# Altium project Input_Accessory.PrjPcb
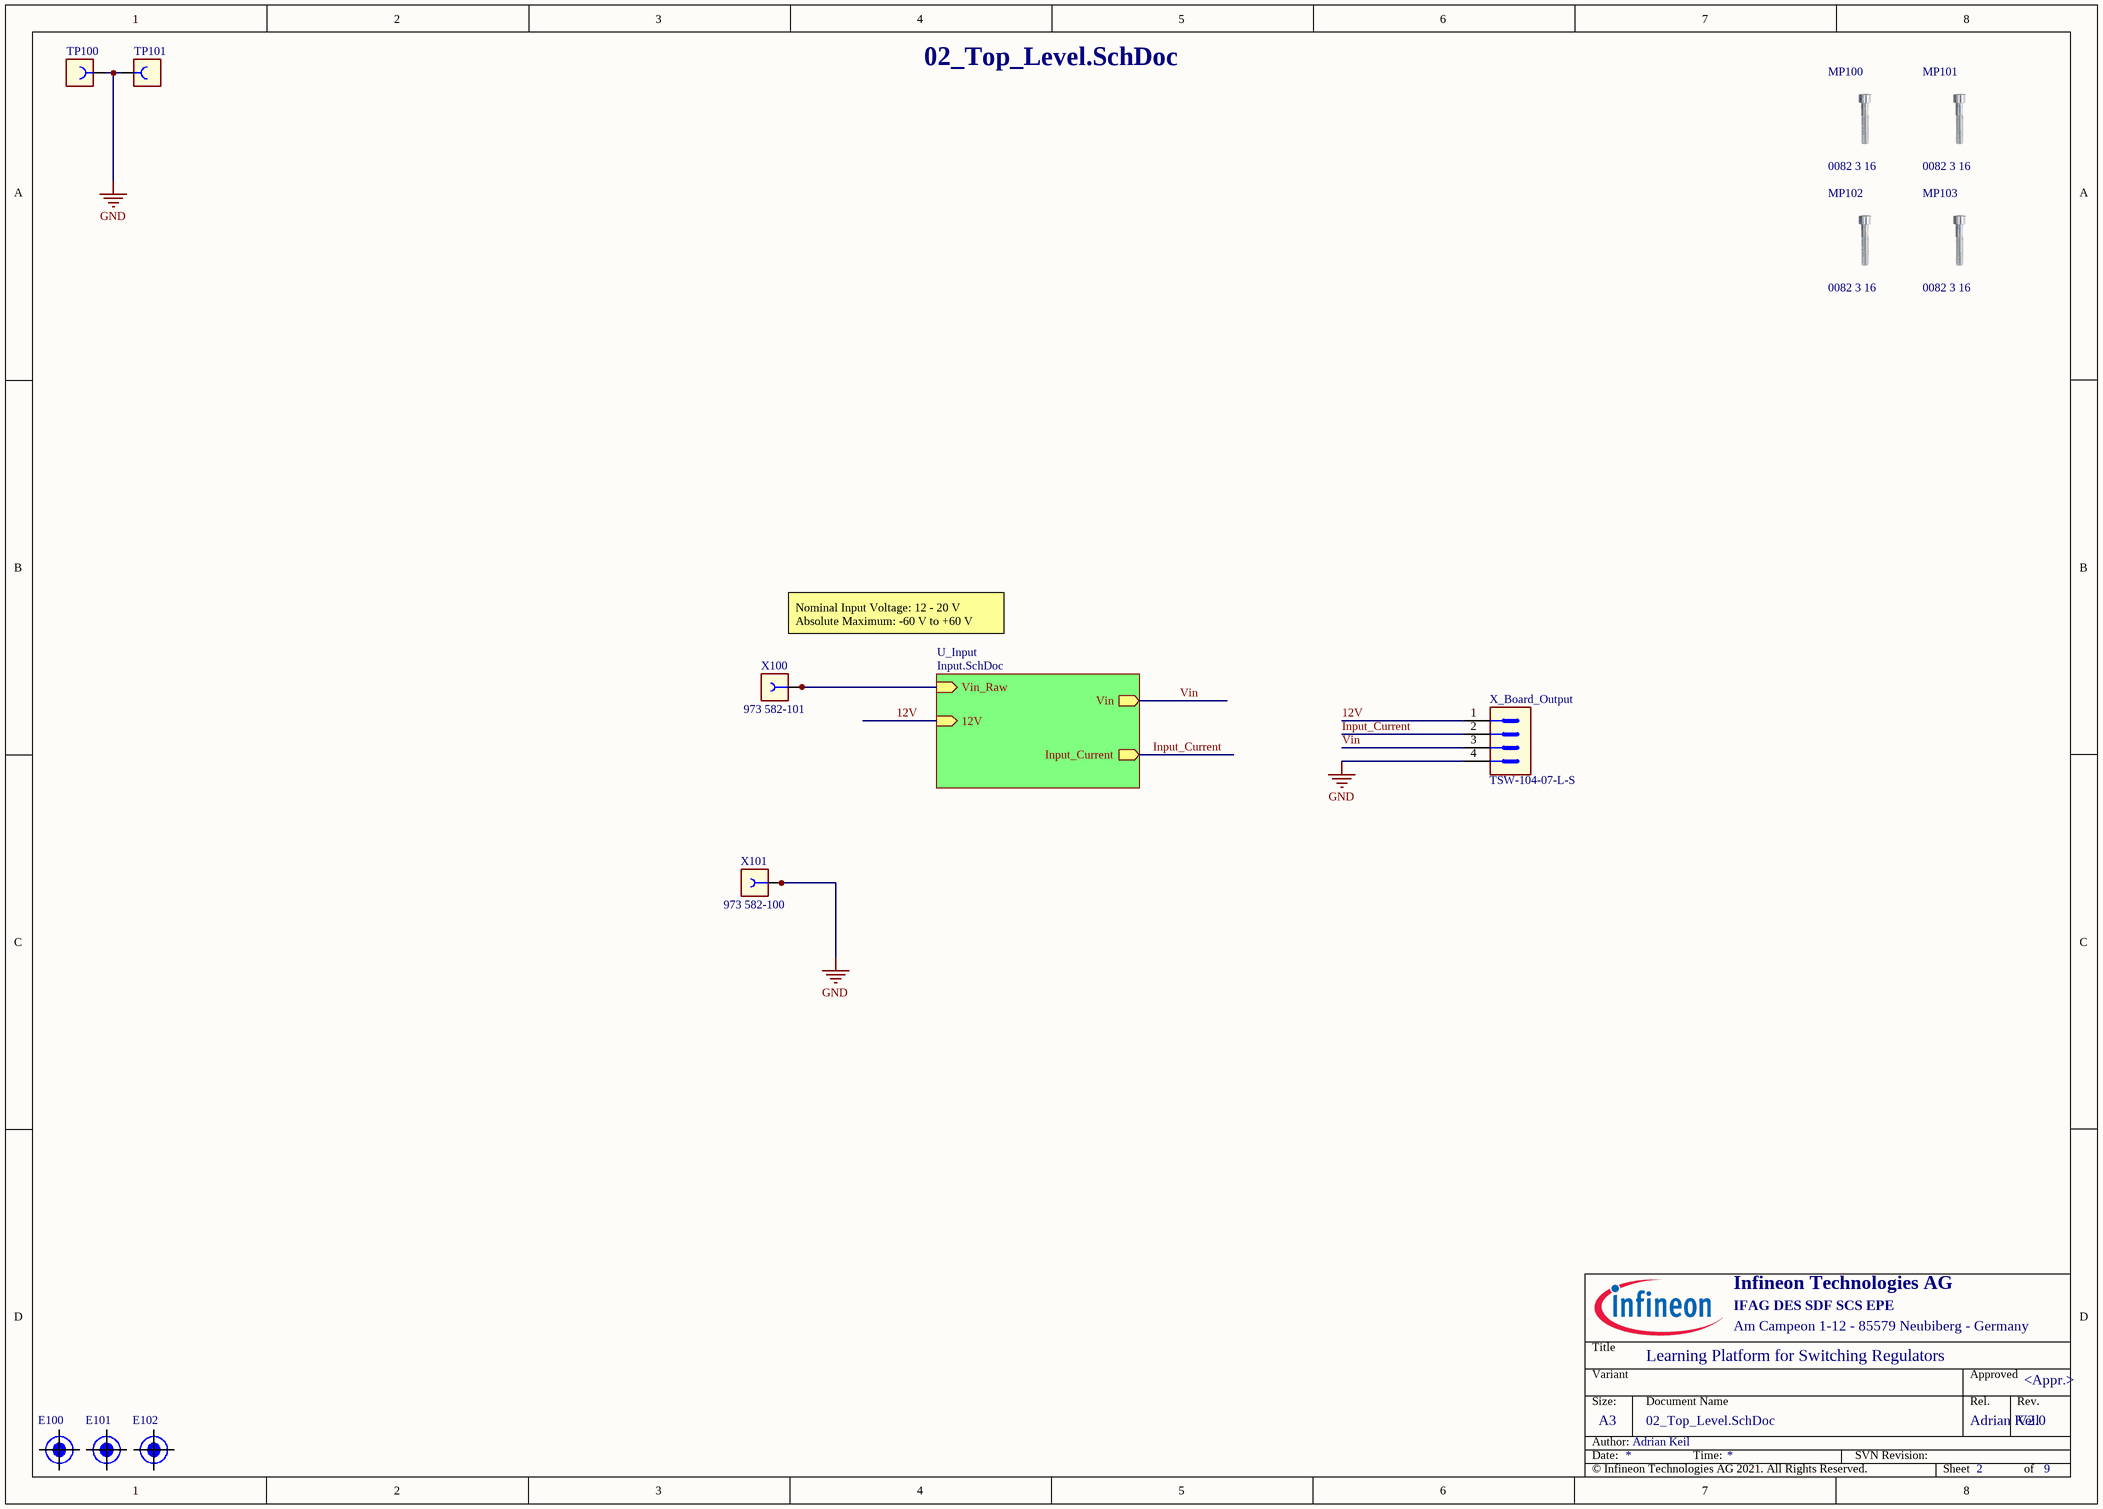
[diagram p0: 02_Top_Level.SchDoc]
PRJ_Address1: IFAG DES SDF SCS EPE; PRJ_Address2: Am Campeon 1-12 - 85579 Neubiberg - Germany; PRJ_Copyright: © Infineon Technologies AG 2021. All Rights Reserved.; PRJ_Engineer: Adrian Keil; PRJ_Organization: Infineon Technologies AG; PRJ_PCB_Release: RC01; PRJ_PCB_Revision: V1.2; PRJ_PCBDesigner: Adrian Keil; PRJ_Responsible: Adrian Keil; PRJ_Revision: V2.0; PRJ_SCH_Author: Adrian Keil; PRJ_SCH_Revision: V2.0; PRJ_Title: Learning Platform for Switching Regulators; PRJ_Year: 12/2021
2 sheets, 45 parts. Net scope: hierarchical (ports join the sheet entries above them; power ports are global).
Board file: Input_Accessory.PcbDoc
Sheets:
  02_Top_Level.SchDoc
    U_Input = Input.SchDoc

## Sheet 02_Top_Level.SchDoc: <Project Name>
size A3; ApprovedBy: <Appr.>; Author: <Author>; CompanyName: Infineon Technologies AG; Engineer: <Rel.>; Organization: Infineon Technologies AG; Address1: COM AC SDC SD3; Address2: Am Campeon 1-12  -  85579 Neubiberg  -  Germany; Address3: 85579 Neubiberg; Address4: Germany; DocumentNumber: 2; Revision: <Rev.>; SheetNumber: 2; SheetTotal: 9; Release: RC00; PageSetup: Record=PageOptions|CenterHorizontal=True|CenterVertical=True|PrintScale=1.01|XCorrection=1.00|YCorrection=1.00|PrintKind=0|BorderSize=5000000|LeftOffset=0|BottomOffset=0|Orientation=2|PaperLength=1000|PaperWidth=1000|Scale=100|PaperSource=7|PrintQuality=-4|MediaType=1|DitherType=10|PaperKind=A3|PrintScaleMode=1; Doc_ConfidentialStatus: <Doc_ConfidentialStatus>; Doc_Preliminary: <Doc_Preliminary>

### Parts
E100  (no value)  [fiducial]  (no BOM)
E101  (no value)  [fiducial]  (no BOM)
E102  (no value)  [fiducial]  (no BOM)
MP100  0082 3 16  [SCREW_0082 3 16_NPTH]
MP101  0082 3 16  [SCREW_0082 3 16_NPTH]
MP102  0082 3 16  [SCREW_0082 3 16_NPTH]
MP103  0082 3 16  [SCREW_0082 3 16_NPTH]
TP100  5011  [CON-THT-TP-5011]  (value not drawn)
TP101  5011  [CON-THT-TP-5011]  (value not drawn)
X100  973 582-101  [CON-THT-973 582- 101]
X101  973 582-100  [CON-THT-973 582- 100]
X_Board_Output  TSW-104-07-L-S  [HDRV4W64P254_1X4_1022X254X838B]

### Sub-sheets
U_Input = Input.SchDoc: Vin_Raw (in), Vin (out), Input_Current (out), 12V (in)

### Nets
GND: TP100.1 TP101.1 X101.1 X101.2 X_Board_Output.4
12V: X_Board_Output.1 ; sheet U_Input/12V
Input_Current: X_Board_Output.2 ; sheet U_Input/Input_Current
Vin: X_Board_Output.3 ; sheet U_Input/Vin
NetQ200_2: X100.1 X100.2 ; sheet U_Input/Vin_Raw

Not connected (* = marked no-connect by the designer): E100 1; E101 1; E102 1

### Notes on the sheet
- Nominal Input Voltage: 12 - 20 V
  Absolute Maximum: -60 V to +60 V
- Title
- Variant
- Approved
- Date:
- Author:
- Size:
- A3
- Document Name
- Time:
- SVN Revision:
- Rel.
- Rev.
- Sheet
- of

### Library data of the parts
E100-E102 = 416637: Fiducial Mark; Legacy PartNumber: MEC10000008; Manufacturer: Infineon Technologies; Alternate View: No; Symbol Type: Fiducial Marker For PCB; Article Number: 416637; Version Number: V01; Legacy DeviceID: MEC_Fiducial_Mark; Combined Parameters: - - -x- -; ComponentStatus: Released; PLMStatus: Active; Second Source allowed: Yes; Voltage DC (max): na; Multible Parts: No; Part Type: Mechanical; Temperature min: 0; Temperature max: 0; Temperature Range: Military; ComponentLink1Description: Vendor WebSite; ComponentLink1URL: https://www.infineon.com/; ComponentLink2Description: Datasheet; ComponentLink2URL: http://webnetprod.muc.infineon.com/PCBPortal_Prod/WorkFlows/AltiumComponent/StandardDocumentation?Versionid=416638; Supplier 1: Farnell; Supplier 2: DigiKey; Supplier 3: Mouser
MP100-MP103 = 455343: Cheese Head Screw With Hexagon Socket, DIN 912 (ISO 4762), M3, 16mm length; Legacy PartNumber: MEC10000167; Manufacturer: Wurth Elektronik; Alternate View: No; Symbol Type: Cheese-Head Screw, M2.5X5-DIN 912; Article Number: 455343; Version Number: V01; Legacy DeviceID: MEC_0082 3 16; Combined Parameters: Steel Hexagonal 19x5.68 Screw; Style: Hexagonal; ComponentStatus: Released; PLMStatus: Active; Second Source allowed: Yes; Voltage DC (max): na; Multiple Parts: No; Part Type: Mechanical; Manufacturer Order Number: 0082 3 16; Value: 0082 3 16; QuickPick: Screw; Type: Screw; Temperature min: 0; Temperature max: 0; Temperature Range: Military; ROHS Compliant: N; Automotive Qualified: No; PackageReference: THT; ComponentLink1Description: Vendor WebSite; ComponentLink1URL: http://www.we-online.com; ComponentLink2Description: Datasheet; ComponentLink2URL: http://webnetprod.muc.infineon.com/PCBPortal_Prod/WorkFlows/AltiumComponent/StandardDocumentation?Versionid=455344; Supplier 1: Farnell; Supplier 2: DigiKey; Supplier 3: Mouser; Package Description: M3 Cheese Head Screw X 5.68mm Head
TP100 TP101 = 382410: PC Test Point-Multipurpose THT, Black; Multiple Parts: No; Legacy PartNumber: CON01500530; Manufacturer: Keystone Electronics Corp.; Symbol Type: Connector, 1 Lead, Female; Alternate View: Yes; Article Number: 382410; Version Number: V01; Legacy DeviceID: KEY_5011; Combined Parameters: Board-to-Cable None (onboard);1x1;Mounting:THT;Orient:0° (vertical);Shielded:No; QuickPick: 0° (vertical) / Board-to-Cable; Style: Not Applicable; ComponentStatus: Released; PLMStatus: Active; Voltage DC (max): na; Part Type: Connector; Manufacturer Order Number: 5011; Value: 5011; Type: Board-to-Cable; Application: Test; Temperature min: 0; Temperature max: 0; Temperature Range: Military; ROHS Compliant: Y; Automotive Qualified: No; ComponentLink1Description: Vendor WebSite; ComponentLink1URL: http://www.keyelco.com/; ComponentLink2Description: Datasheet; ComponentLink2URL: http://webnetprod.muc.infineon.com/PCBPortal_Prod/WorkFlows/AltiumComponent/StandardDocumentation?Versionid=382411; Supplier 1: Farnell; Supplier Part Number 1: 2431148; Supplier 2: DigiKey; Supplier Part Number 2: 36-5011-ND; Supplier 3: Mouser; Supplier Part Number 3: 534-5011; Second Source allowed: Yes; Package Description: Test Point, 1.78 mm Lead Width, Round, 3.17 mm Dia X 8.28 mm H body
X100 = 377341: Banana Socket, Red, 17.5mm Pitch; Legacy PartNumber: CON01500041; Manufacturer: Hirschmann Test & Measurement; Manufacturer Component Status: Active; Symbol Type: Banana Socket 2 Pins; Article Number: 377341; Version Number: V01; Legacy DeviceID: HTM_973 582- 101; Combined Parameters: Board-to-Cable Socket (female);2x1;Mounting:THT;Orient:90° (right angle);Shielded:No; QuickPick: 90° (right angle) / Board-to-Cable; ComponentStatus: Released; Second Source allowed: Yes; Voltage DC (max): na; Part Type: Connector; Manufacturer Order Number: 973 582-101; Value: 973 582-101; Type: Board-to-Cable; Style: Banana; Temperature min: -25; Temperature max: 85; Temperature Range: Military; ROHS Compliant: N; ComponentLink1Description: Vendor WebSite; ComponentLink1URL: http://www.sks-kontakt.de/; ComponentLink2Description: Datasheet; ComponentLink2URL: http://webnetprod.muc.infineon.com/PCBPortal_Prod/WorkFlows/AltiumComponent/StandardDocumentation?Versionid=377342; Supplier 1: Farnell; Supplier Part Number 1: 497332; Supplier 2: DigiKey; Supplier 3: Mouser; Supplier Part Number 3: 845-973582101; PLMStatus: Active; Package Description: Banana Jack, 2 pins, 17.5mm Pitch, 21mm L X 7.5mm W X 10.5mm H body
X101 = 377401: Banana Socket, black, 17.5mm Pitch; Legacy PartNumber: CON01500045; Manufacturer: Hirschmann Test & Measurement; Manufacturer Component Status: Active; Symbol Type: Banana Socket 2 Pins; Article Number: 377401; Version Number: V01; Legacy DeviceID: HTM_973 582- 100; Combined Parameters: Board-to-Cable Socket (female);-x-;Mounting:THT;Orient:90° (right angle);Shielded:No; QuickPick: 90° (right angle) / Board-to-Cable; Automotive Qualified: No; ComponentStatus: Released; Second Source allowed: Yes; Voltage DC (max): na; Part Type: Connector; Manufacturer Order Number: 973 582-100; Value: 973 582-100; Type: Board-to-Cable; Style: Banana; Temperature min: -25; Temperature max: 85; Temperature Range: Military; ROHS Compliant: N; ComponentLink1Description: Vendor WebSite; ComponentLink1URL: http://www.sks-kontakt.de/; ComponentLink2Description: Datasheet; ComponentLink2URL: http://webnetprod.muc.infineon.com/PCBPortal_Prod/WorkFlows/AltiumComponent/StandardDocumentation?Versionid=377402; Supplier 1: Farnell; Supplier Part Number 1: 497344; Supplier 2: DigiKey; Supplier 3: Mouser; Supplier Part Number 3: 845-973582100; PLMStatus: Active; Package Description: Banana Jack, 2 pins, 17.5mm Pitch, 21mm L X 7.5mm W X 10.5mm H body
X_Board_Output = 378073: Through hole .025 SQ Post Header, 2.54mm pitch, 4 pin, vertical, single row; Legacy PartNumber: CON01500102; Manufacturer: Samtec; Article Number: 378073; Version Number: V01; Legacy DeviceID: SAM_TSW-104-07-L-S; Combined Parameters: Board-to-Board Header (male);4x1;Mounting:THT;Orient:0° (vertical);Shielded:No; QuickPick: 0° (vertical) / Board-to-Board; Style: Strip; Automotive Qualified: No; ComponentStatus: Released; PLMStatus: Active; Second Source allowed: Yes; Voltage DC (max): na; Part Type: Connector; Manufacturer Order Number: TSW-104-07-L-S; Value: TSW-104-07-L-S; Type: Board-to-Board; Temperature min: -55; Temperature max: 125; Temperature Range: Military; ROHS Compliant: Y; ComponentLink1Description: Vendor WebSite; ComponentLink1URL: http://www.samtec.com/; ComponentLink2Description: Datasheet; ComponentLink2URL: http://webnetprod.muc.infineon.com/PCBPortal_Prod/WorkFlows/AltiumComponent/StandardDocumentation?Versionid=378074; Supplier 1: Farnell; Supplier Part Number 1: 2035607; Supplier 2: DigiKey; Supplier Part Number 2: SAM1031-04-ND; Supplier 3: Mouser; Package Description: Header,vertical,2.54mm pitch;0.64mm lead width,4 pins,1 row,4 pins per row,10.225mm L X 2.54mm W X 8.38mm H body

## Sheet Input.SchDoc: <Project Name>
size A3; ApprovedBy: <Appr.>; Author: <Author>; CompanyName: Infineon Technologies AG; Engineer: <Rel.>; Organization: Infineon Technologies AG; Address1: IFAG DES S PS; Address2: Am Campeon 1-12  -  85579 Neubiberg  -  Germany; Address3: 85579 Neubiberg; Address4: Germany; DocumentNumber: 3; Revision: <Rev.>; SheetNumber: 3; SheetTotal: 9; Release: RC00; PageSetup: Record=PageOptions|CenterHorizontal=True|CenterVertical=True|PrintScale=1.01|XCorrection=1.00|YCorrection=1.00|PrintKind=0|BorderSize=5000000|LeftOffset=0|BottomOffset=0|Orientation=2|PaperLength=1000|PaperWidth=1000|Scale=100|PaperSource=7|PrintQuality=-4|MediaType=1|DitherType=10|PaperKind=A3|PrintScaleMode=1; Doc_ConfidentialStatus: <Doc_ConfidentialStatus>; Doc_Preliminary: <Doc_Preliminary>
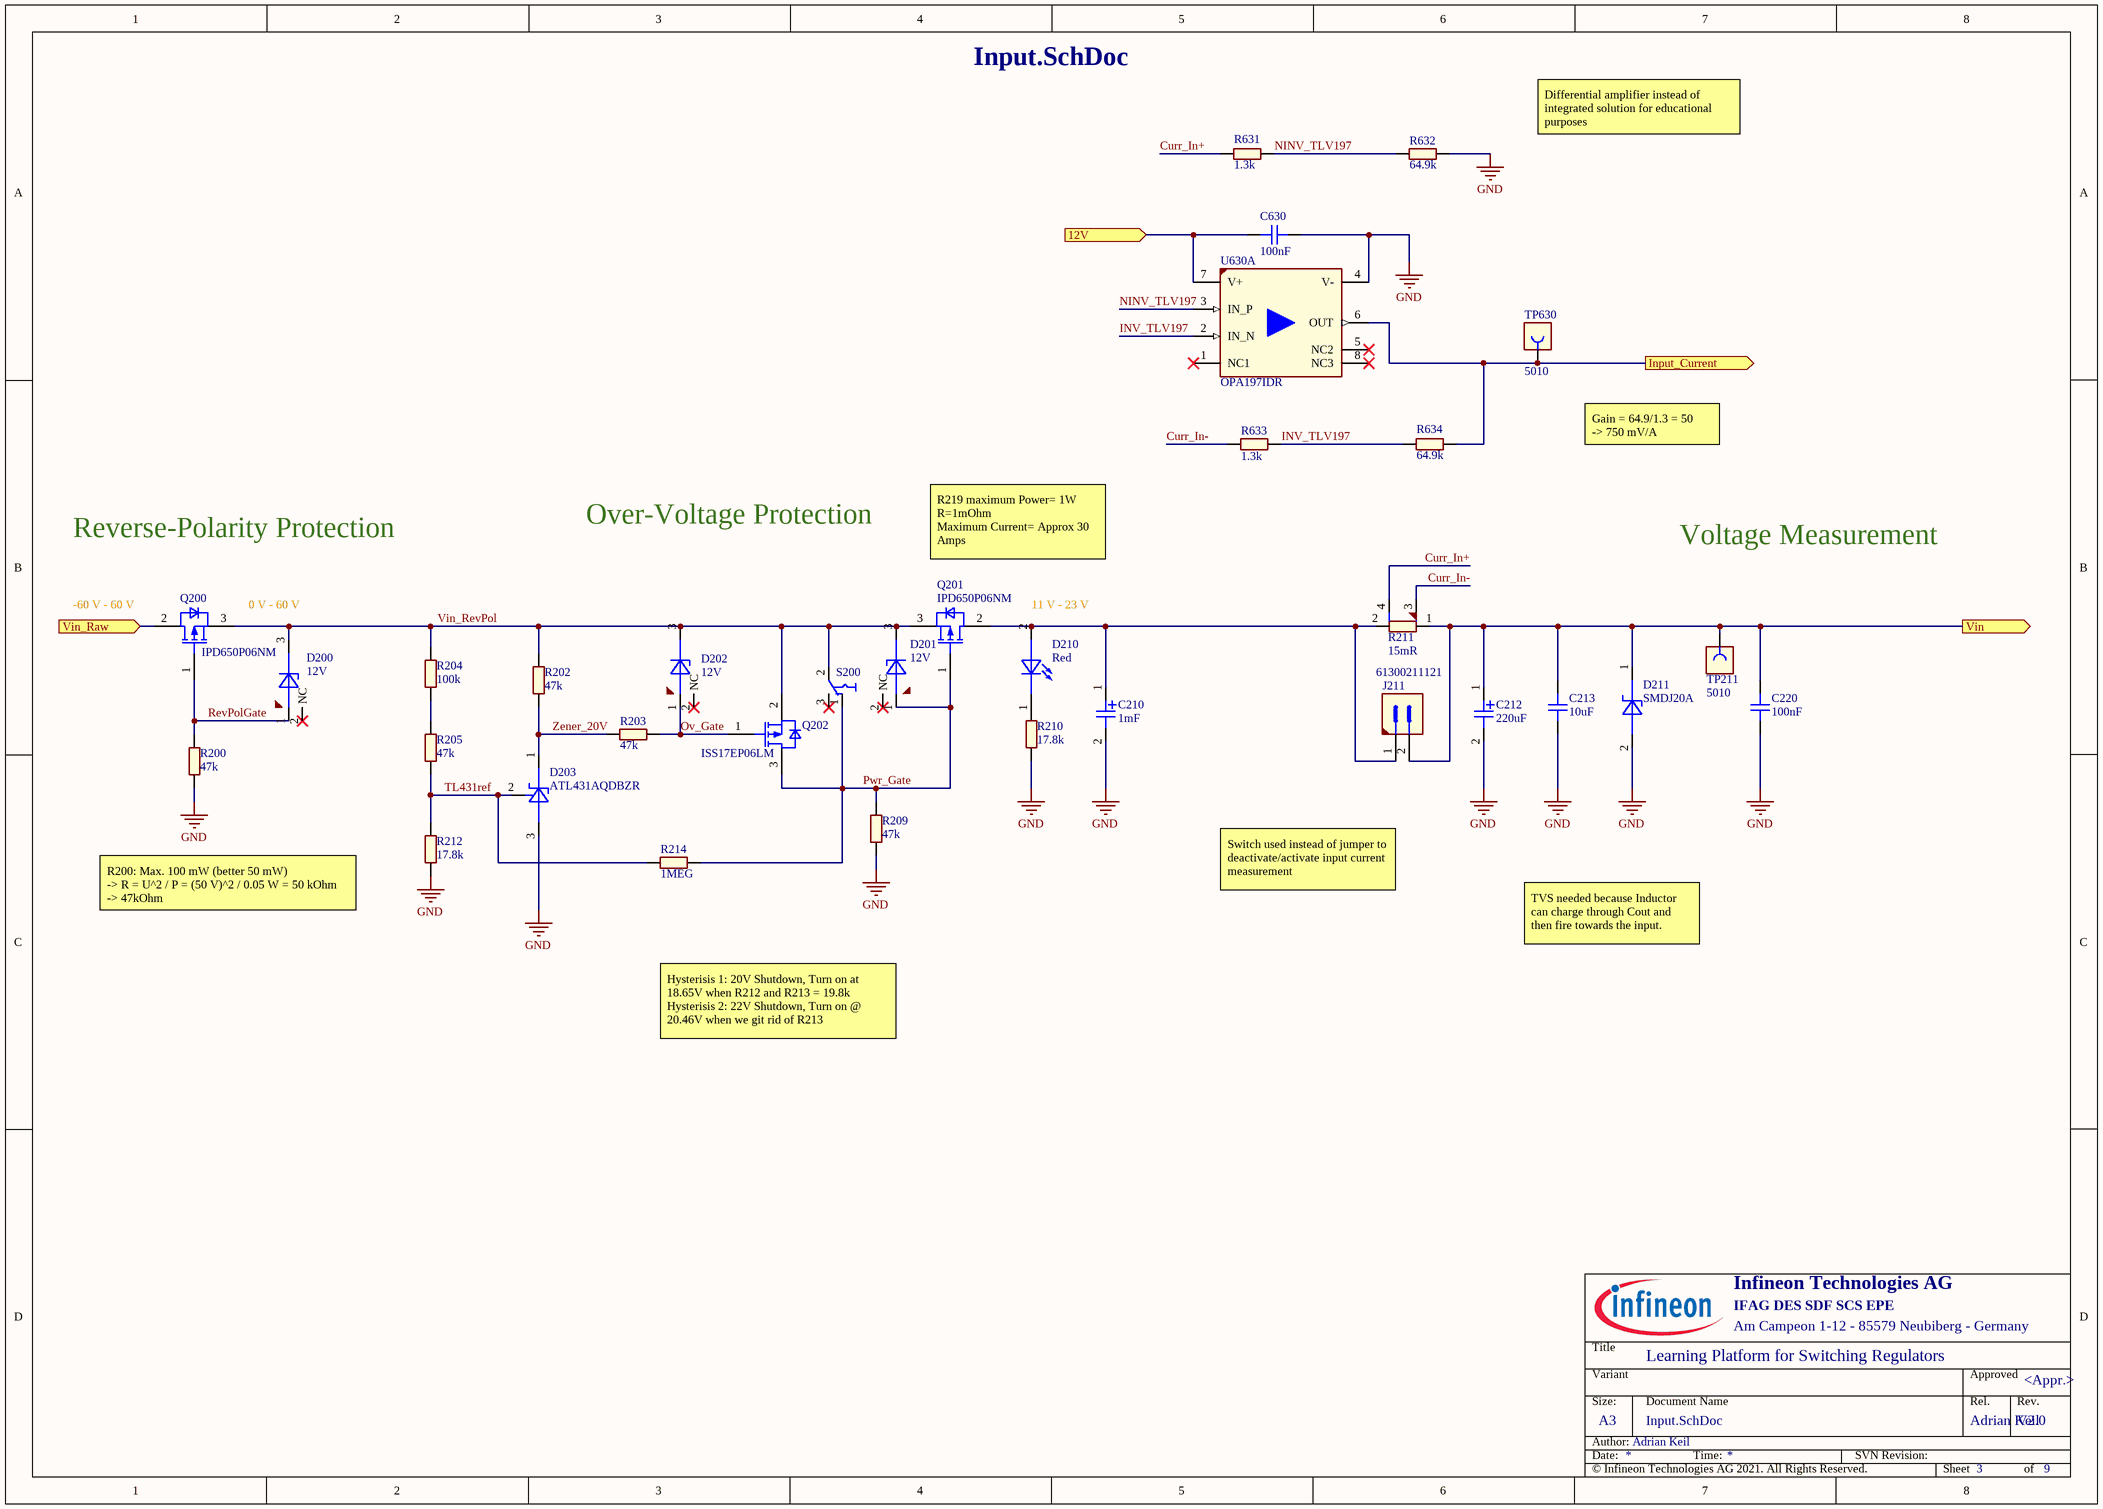
[diagram p1: Input.SchDoc]

### Parts
C210  1mF  [CAPPRD500W60D1300H2700B]
C212  220uF  [CAPAE1030X1050N-3]
C213  10uF  [CAPC3216X190N-1]
C220  100nF  [CAPC3216X125N-0]
C630  100nF  [CAPC3216X125N-0]
D200  12V  [SOT95P230X110-3N]
D201  12V  [SOT95P230X110-3N]
D202  12V  [SOT95P230X110-3N]
D203  ATL431AQDBZR  [SOT95P237X112-3N-1]
D210  Red  [LEDSC160X80X80-2N-1]
D211  SMDJ20A  [DIOM7959X262N]
J211  61300211121  [CON-M-THT-61300211121]
Q200  IPD650P06NM  [TO228P998X250-3N-V2]
Q201  IPD650P06NM  [TO228P998X250-3N-V2]
Q202  ISS17EP06LM  [SOT95P240X110-3N-1-V]
R200  47k  [RESC3216X60N]
R202  47k  [RESC3216X60N]
R203  47k  [RESC3216X60N]
R204  100k  [RESC3216X60N]
R205  47k  [RESC3216X60N]
R209  47k  [RESC3216X60N]
R210  17.8k  [RESC3216X60N]
R211  15mR  [RES-SMD-L4T12]
R212  17.8k  [RESC3216X60N]
R214  1MEG  [RESC3216X60N]
R631  1.3k  [RESC3216X60N]
R632  64.9k  [RESC3216X60N]
R633  1.3k  [RESC3216X60N]
R634  64.9k  [RESC3216X60N]
S200  CL-SB-12A-01T  [SW-SMD-CL-SB-12A-01T]  (value not drawn)
TP211  5010  [CON-THT-TP-5010]
TP630  5010  [CON-THT-TP-5010]
U630  OPA197IDR  [SOIC127P600X175-8N-23]  (part A of 2)

### Ports
12V (in), Input_Current (out), Vin (out), Vin_Raw (in)

### Nets
GND: C210.2 C212.2 C213.1 C220.2 C630.1 D203.3(ANODE) D211.2(ANODE) R200.1 R209.1 R210.2 R212.2 R632.2 U630.4(V-)
12V: C630.2 U630.7(V+) ; port 12V
Curr_In+: R211.4(I2) R631.1
Curr_In-: R211.3(I1) R633.1
Input_Current: R634.2 TP630.1 U630.6(OUT) ; port Input_Current
INV_TLV197: R633.2 R634.1 U630.2(IN_N)
NINV_TLV197: R631.2 R632.1 U630.3(IN_P)
Ov_Gate: D202.1(ANODE) Q202.1(GATE) R203.1
Pwr_Gate: D201.1(ANODE) Q201.1(GATE) Q202.3(DRAIN) R209.2 R214.2 S200.1
RevPolGate: D200.1(ANODE) Q200.1(GATE) R200.2
TL431ref: D203.2(REF) R205.1 R212.1 R214.1
Vin: C212.1 C213.2 C220.1 D211.1(CATHODE) J211.2 R211.1(V1) TP211.1 ; port Vin
Vin_RevPol: D200.3(CATHODE) D201.3(CATHODE) D202.3(CATHODE) Q200.3(SOURCE) Q201.3(SOURCE) Q202.2(SOURCE) R202.2 R204.1 S200.2
Zener_20V: D203.1(CATHODE) R202.1 R203.2
NetC210_1: C210.1 D210.2(Anode) J211.1 Q201.2(DRAIN) R211.2(V2)
NetD210_1: D210.1(Cathode) R210.1
NetQ200_2: Q200.2(DRAIN) ; port Vin_Raw
NetR204_2: R204.2 R205.2

Not connected (* = marked no-connect by the designer): D200 2(NC)*; D201 2(NC)*; D202 2(NC)*; S200 3*; U630 1(NC1)* 5(NC2)* 8(NC3)*

### Notes on the sheet
- Differential amplifier instead of integrated solution for educational purposes
- Gain = 64.9/1.3 = 50
  -> 750 mV/A
- Reverse-Polarity Protection
- Over-Voltage Protection
- R219 maximum Power= 1W
  R=1mOhm
  Maximum Current= Approx 30 Amps
- Voltage Measurement
- (near Q200) -60 V - 60 V
- 0 V - 60 V
- (near D210) 11 V - 23 V
- R200: Max. 100 mW (better 50 mW)
  -> R = U^2 / P = (50 V)^2 / 0.05 W = 50 kOhm
  -> 47kOhm
- Switch used instead of jumper to deactivate/activate input current measurement
- TVS needed because Inductor can charge through Cout and then fire towards the input.
- Hysterisis 1: 20V Shutdown, Turn on at 18.65V when R212 and R213 = 19.8k
  Hysterisis 2: 22V Shutdown, Turn on @ 20.46V when we git rid of R213
- Title
- Variant
- Approved
- Date:
- Author:
- Size:
- A3
- Document Name
- Time:
- SVN Revision:
- Rel.
- Rev.
- Sheet
- of

### Library data of the parts
C210 = 646789: CAP / ELCO / 1mF / 35V / 20% / Aluminiumelectrolytic / -40°C to 105°C / 5.00mm C X 0.60mm W 13.00mm Dia X 27.00mm H / - / -; Multible Parts: No; Manufacturer: Kemet; Manufacturer Order Number: ESY108M035AL4AA; Symbol Type: Capacitor; Single; Polarized; 2 Pins; Pin 1 Positive; Alternate View: Yes; Article Number: 646789; Version Number: V01; Combined Parameters: TC:Aluminiumelectrolytic;Tol.:-20%/+20%;Vdc:35V; QuickPick: 1mF / 35V / 20% / Aluminiumelectrolytic / Radial; Type: Polarized; Style: Single; ComponentStatus: Released; PLMStatus: Active; Part Type: Capacitor; Value: 1mF; Tolerance Neg: 20%; Tolerance Pos: 20%; Application: Standard; Technology: Electrolytic; Temperature min: -40; Temperature max: 105; Temperature Range: Industrial; ROHS Compliant: Y; Automotive Qualified: No; PackageReference: Radial; ComponentLink1Description: Vendor WebSite; ComponentLink1URL: http://www.kemet.com; ComponentLink2Description: Datasheet; ComponentLink2URL: http://webnetprod.muc.infineon.com/PCBPortal_Prod/WorkFlows/AltiumComponent/StandardDocumentation?Versionid=646790; Supplier 1: Farnell; Supplier Part Number 1: 2835188; Supplier 2: DigiKey; Supplier Part Number 2: 399-6120-ND; Supplier 3: Mouser; Supplier Part Number 3: 80-ESY108M035AL4AA; Second Source allowed: Yes; Voltage DC (max): 35V; Package Description: Capacitor,polarized,Radial;5.00mm C X 0.60mm W 13.00mm Dia X 27.00mm H
C212 = 699376: CAP / ELCO / 220uF / 50V / 20% / Aluminiumelectrolytic / -55°C to 105°C / 10.30mm L X 10.30mm W X 10.50mm H / - / -; Multible Parts: No; Manufacturer: Nippon Chemi-Con; Manufacturer Order Number: EMZL500ARA221MJA0G; Symbol Type: Capacitor; Single; Polarized; 2 Pins; Pin 1 Positive; Alternate View: Yes; Article Number: 699376; Version Number: V00; Combined Parameters: TC:Aluminiumelectrolytic;Tol.:-20%/+20%;Vdc:50V; QuickPick: 220uF / 50V / 20% / Aluminiumelectrolytic / EMZL500ARA221MJA0G; Type: Polarized; Style: Single; Automotive Qualified: AEC Q200; ComponentStatus: Released; PLMStatus: Active; Part Type: Capacitor; Value: 220uF; Tolerance Neg: 20%; Tolerance Pos: 20%; Application: Standard; Technology: Electrolytic; Temperature min: -55; Temperature max: 105; Temperature Range: Military; ROHS Compliant: Y; PackageReference: EMZL500ARA221MJA0G; ComponentLink1Description: Vendor WebSite; ComponentLink1URL: http://www.chemi-con.co.jp/e/; ComponentLink2Description: Datasheet; ComponentLink2URL: http://webnetprod.muc.infineon.com/PCBPortal_Prod/WorkFlows/AltiumComponent/StandardDocumentation?Versionid=699377; Supplier 1: Farnell; Supplier 2: DigiKey; Supplier 3: Mouser; Supplier Part Number 3: 661-EMZL500ARA221MJA; Second Source allowed: Yes; Voltage DC (max): 50V; Package Description: Capacitor,Aluminum Electrolytic;10.30mm L X 10.30mm W X 10.50mm H
C213 = 648992: CAP / CERA / 10uF / 50V / 20% / X5R (EIA) / -55°C to 85°C / 1206 (3216) / SMD / -; Multiple Parts: No; Manufacturer: Taiyo Yuden; Manufacturer Order Number: UMK316BBJ106ML-T; Symbol Type: Capacitor; Single; Standard; 2 Pins; Alternate View: Yes; Article Number: 648992; Version Number: V00; Combined Parameters: TC:X5R (EIA);Tol.:-20%/+20%;Vdc:50V; QuickPick: 10uF / 50V / 20% / X5R (EIA) / 1206 (3216); Type: Standard; Style: Single; ComponentStatus: Released; PLMStatus: Active; Part Type: Capacitor; Value: 10uF; Tolerance Neg: 20%; Tolerance Pos: 20%; Application: Standard; Technology: Ceramic; Temperature min: -55; Temperature max: 85; Temperature Range: Military; ROHS Compliant: Y; Automotive Qualified: No; PackageReference: 1206 (3216); ComponentLink1Description: Vendor WebSite; ComponentLink1URL: http://www.yuden.co.jp/or/product/; ComponentLink2Description: Datasheet; ComponentLink2URL: http://webnetprod.muc.infineon.com/PCBPortal_Prod/WorkFlows/AltiumComponent/StandardDocumentation?Versionid=648993; Supplier 1: Farnell; Supplier Part Number 1: 2779059; Supplier 2: DigiKey; Supplier Part Number 2: 587-3248-1-ND; Supplier 3: Mouser; Supplier Part Number 3: 963-UMK316BBJ106ML-T; Second Source allowed: Yes; Voltage DC (max): 50V; Package Description: Capacitor,non-polarized,Chip;3.20mm L X 1.60mm W X 1.90mm H
C220 C630 = 282874: CAP / CERA / 100nF / 50V / 10% / X7R (EIA) / -55°C to 125°C / 1206(3216) / SMD / -; Multiple Parts: No; Legacy PartNumber: CAP01005660; Manufacturer: MuRata; Manufacturer Order Number: GRM31MR71H104KA01; Symbol Type: Capacitor; Single; Standard; 2 Pins; Alternate View: Yes; Article Number: 282874; Version Number: V01; Combined Parameters: TC:X7R (EIA);Tol.:-10%/+10%;Vdc:50V; QuickPick: 100nF / 50V / 10% / X7R (EIA) / 1206 (3216); Type: Standard; Style: Single; Package Metric: 3216; Package Imperial: 1206; ComponentStatus: Released; PLMStatus: Obsolete; Legacy DeviceID: CAP01005660; Part Type: Capacitor; Value: 100nF; Tolerance Neg: 10%; Tolerance Pos: 10%; Application: Standard; Technology: Ceramic; Temperature min: -55; Temperature max: 125; Temperature Range: Military; ROHS Compliant: Y; Automotive Qualified: No; PackageReference: 1206 (3216); ComponentLink1Description: Vendor WebSite; ComponentLink1URL: http://www.murata.com/; ComponentLink2Description: Datasheet; ComponentLink2URL: http://webnetprod.muc.infineon.com/PCBPortal_Prod/WorkFlows/AltiumComponent/StandardDocumentation?Versionid=282875; Supplier 1: Farnell; Supplier 2: DigiKey; Supplier 3: Mouser; Second Source allowed: Yes; Voltage DC (max): 50V; Package Description: Capacitor,non-polarized,Chip;3.20mm L X 1.60mm W X 1.25mm H
D200-D202 = 659605: Voltage regulator diodes; Multiple Parts: No; Manufacturer: Nexperia; Manufacturer Order Number: BZX84-C12,215; Symbol Type: Standard Zener Diode, 3 Pins, 1 Anode, 2 Not Connected, 3 Cathode; Alternate View: Yes; Article Number: 659605; Version Number: V00; Combined Parameters: Vf:900mV;If:10mA;Ur:8V;Ir:100nA;Pmax:250mW; QuickPick: Zener Diode / SOT-23; Type: Zener Diode; Style: Single; Automotive Qualified: AEC Q101; ComponentStatus: Released; PLMStatus: Active; Voltage DC (max): na; Part Type: Diode; Value: 12V; Application: Standard; Temperature min: -65; Temperature max: 150; Temperature Range: Military; ROHS Compliant: Y; PackageReference: SOT-23; ComponentLink1Description: Vendor WebSite; ComponentLink1URL: http://www.nexperia.com; ComponentLink2Description: Datasheet; ComponentLink2URL: http://webnetprod.muc.infineon.com/PCBPortal_Prod/WorkFlows/AltiumComponent/StandardDocumentation?Versionid=659606; Supplier 1: Farnell; Supplier Part Number 1: 1081407; Supplier 2: DigiKey; Supplier Part Number 2: 1727-2936-1-ND; Supplier 3: Mouser; Supplier Part Number 3: 771-BZX84-C12-T/R; Second Source allowed: Yes; Package Description: SOT,0.95mm,pitch;3 pin,1.30mm W X 2.90mm L X 1.10mm H body
D203 = 644060: ATL431 Adjustable Precision Shunt Regulator; Manufacturer: Texas Instruments; Symbol type: TVS Diode Symbol, 1 Cathode, 2 Reference , 3 Anode; Article Number: 644060; Version Number: V01; Legacy DeviceID: TI_ATL431AQDBZR; Combined Parameters: - -;Vdc min/max:-;Iout:-;Fmax:-; QuickPick: SOT23-3 (DBZ); Automotive Qualified: No; ComponentStatus: Released; PLMStatus: Active; Second Source allowed: Yes; Voltage DC (max): na; Part Type: Integrated Circuit; Manufacturer Order Number: ATL431AQDBZR; Value: ATL431AQDBZR; Temperature min: -40; Temperature max: 125; Temperature Range: Automotive; ROHS Compliant: Y; PackageReference: SOT23-3 (DBZ); ComponentLink1Description: Vendor WebSite; ComponentLink1URL: http://www.ti.com; ComponentLink2Description: Datasheet; ComponentLink2URL: http://webnetprod.muc.infineon.com/PCBPortal_Prod/WorkFlows/AltiumComponent/StandardDocumentation?Versionid=644061; Supplier 1: Farnell; Supplier 2: DigiKey; Supplier Part Number 2: 296-47201-1-ND; Supplier 3: Mouser; Supplier Part Number 3: 595-ATL431AQDBZR; Package Description: SOT,0.95mm pitch;3 pin,1.30mm W X 2.92mm L X 1.12mm H body
D210 = 625459: WL-SMCW SMT Mono-color Chip LED Waterclear, Red,630nm; Manufacturer: Wurth Elektronik; Manufacturer Order Number: 150060RS75000; Symbol Type: Standard LED Symbol, 1 Cathode, 2 Anode; Article Number: 625459; Version Number: V01; Combined Parameters: Vf:2.4V;If:30mA;Ur:5V;Ir:10uA;Pmax:72mW; QuickPick: LED / 1608 (0603); Style: Single; Automotive Qualified: No; ComponentStatus: Released; PLMStatus: Active; Second Source allowed: Yes; Voltage DC (max): na; Part Type: Diode; Value: Red; Type: LED; Application: Standard; Temperature min: -40; Temperature max: 85; Temperature Range: Industrial; ROHS Compliant: Y; PackageReference: 1608 (0603); ComponentLink1Description: Vendor WebSite; ComponentLink1URL: http://www.we-online.com; ComponentLink2Description: Datasheet; ComponentLink2URL: http://webnetprod.muc.infineon.com/PCBPortal_Prod/WorkFlows/AltiumComponent/StandardDocumentation?Versionid=625460; Supplier 1: Farnell; Supplier Part Number 1: 2322071; Supplier 2: DigiKey; Supplier Part Number 2: 732-4978-1-ND; Supplier 3: Mouser; Supplier Part Number 3: 710-150060RS75000; Package Description: LED,Side Concave; 2 pin,1.60mm W X 0.80mm L X 0.80mm H
D211 = 646382: TVS Diode, Low Profile Package, Built in Strain Relief, Glass Passivated Chip Junction; Manufacturer: Littelfuse; Symbol Type: Transient Voltage Suppressor Diode (TVS, TAZ), 1 Cathode, 2 Anode; Article Number: 646382; Version Number: V01; Combined Parameters: Vf:5V;If:-;Ur:20V;Ir:2uA;Pmax:6.5W; QuickPick: TVS Diode / DO-214AB; Style: Single; Automotive Qualified: No; ComponentStatus: Released; PLMStatus: Active; Second Source allowed: Yes; Voltage DC (max): na; Part Type: Diode; Manufacturer Order Number: SMDJ20A; Value: SMDJ20A; Type: TVS Diode; Application: Standard; Temperature min: -65; Temperature max: 150; Temperature Range: Military; ROHS Compliant: Y; PackageReference: DO-214AB; ComponentLink1Description: Vendor WebSite; ComponentLink1URL: http://www.littelfuse.com/; ComponentLink2Description: Datasheet; ComponentLink2URL: http://webnetprod.muc.infineon.com/PCBPortal_Prod/WorkFlows/AltiumComponent/StandardDocumentation?Versionid=646383; Supplier 1: Farnell; Supplier Part Number 1: 2777300; Supplier 2: DigiKey; Supplier Part Number 2: SMDJ20ACT-ND; Supplier 3: Mouser; Supplier Part Number 3: 576-SMDJ20A; Package Description: Diode,Molded Body;7.94mm L X 5.905mm W X 2.62mm H
J211 = 386760: Header, 2.54mm Pitch, 2 pin, Vertical, Single Row; Legacy PartNumber: CON01500943; Manufacturer: Wurth Elektronik; Alternat View: Yes; Article Number: 386760; Version Number: V01; Legacy DeviceID: WE_61300211121; Combined Parameters: Board-to-Board Header (male);2x1;Mounting:THT;Orient:0° (vertical);Shielded:No; QuickPick: 0° (vertical) / Board-to-Board; Style: Strip; Automotive Qualified: No; ComponentStatus: Released; PLMStatus: Active; Voltage DC (max): na; Part Type: Connector; Manufacturer Order Number: 61300211121; Value: 61300211121; Type: Board-to-Board; Temperature min: -40; Temperature max: 105; Temperature Range: Industrial; ROHS Compliant: Y; ComponentLink1Description: Vendor WebSite; ComponentLink1URL: http://www.we-online.com; ComponentLink2Description: Datasheet; ComponentLink2URL: http://webnetprod.muc.infineon.com/PCBPortal_Prod/WorkFlows/AltiumComponent/StandardDocumentation?Versionid=386761; Supplier 1: Farnell; Supplier Part Number 1: 2356153; Supplier 2: DigiKey; Supplier Part Number 2: 732-5315-ND; Supplier 3: Mouser; Supplier Part Number 3: 710-61300211121; Second Source allowed: Yes; Package Description: Header, Vertical, 2.54mm Pitch; 2 Pins, Single row, 5.08mm L X 2.54mm W X 8.89mm H body
Q200 Q201 = 644075: OptiMOS Power Transistor, -60 V; Manufacturer: Infineon Technologies; Symbol Type: Insulated-Gate Field-Effect Transistor (IGFET), P-Channel, Enhancement,  Body Diode, Pin 1 Gate, 2 Drain, 3 Source, 3 Pins; Article Number: 644075; Version Number: V01; Legacy DeviceID: IFX_IPD650P06NM; Combined Parameters: P-Channel Enhancement;Uds:-60V;Id:-22A;Rds:65R;P:83W; QuickPick: P-Channel Enhancement / 83W / -22A / -60V / PG-TO252-3-313; Type: P-Channel Enhancement; Style: Single; Automotive Qualified: No; ComponentStatus: Released; PLMStatus: Active; Second Source allowed: Yes; Voltage DC (max): na; Part Type: Transistor FET; Manufacturer Order Number: IPD650P06NM; Value: IPD650P06NM; Application: Power Electronics; Temperature min: -55; Temperature max: 175; Temperature Range: Military; ROHS Compliant: Y; PackageReference: PG-TO252-3-313; ComponentLink1Description: Vendor WebSite; ComponentLink1URL: https://www.infineon.com/; ComponentLink2Description: Datasheet; ComponentLink2URL: http://webnetprod.muc.infineon.com/PCBPortal_Prod/WorkFlows/AltiumComponent/StandardDocumentation?Versionid=644076; Supplier 1: Farnell; Supplier Part Number 1: 3267848; Supplier 2: DigiKey; Supplier Part Number 2: 448-IPD650P06NMATMA1CT-ND; Supplier 3: Mouser; Supplier Part Number 3: 726-IPD650P06NMATMA1; Package Description: TO,2.28mm pitch;2 pin,9.98mm L X 6.50mm W X 2.50mm H body
Q202 = 615536: OptiMOSTM Small Signal Transistor, -60 V; Manufacturer: Infineon Technologies; Symbol Type: Insulated-Gate Field-Effect Transistor (IGFET), P-Channel, Enhancement,  Body Diode, Pin 1 Gate, 2 Source, 3 Drain, 3 Pins; Article Number: 615536; Version Number: V01; Legacy DeviceID: IFX_ISS17EP06LM; Combined Parameters: P-Channel Enhancement;Uds:-60V;Id:-300mA;Rds:1.7R;P:360mW; QuickPick: P-Channel Enhancement / 360mW / -300mA / -60V / PG-SOT23-3-5; Type: P-Channel Enhancement; Style: Single; Automotive Qualified: No; ComponentStatus: Released; PLMStatus: Active; Second Source allowed: Yes; Voltage DC (max): na; Part Type: Transistor FET; Manufacturer Order Number: ISS17EP06LM; Value: ISS17EP06LM; Application: Small Signal; Temperature min: -55; Temperature max: 150; Temperature Range: Military; ROHS Compliant: Y; PackageReference: PG-SOT23-3-5; ComponentLink1Description: Vendor WebSite; ComponentLink1URL: https://www.infineon.com/; ComponentLink2Description: Datasheet; ComponentLink2URL: http://webnetprod.muc.infineon.com/PCBPortal_Prod/WorkFlows/AltiumComponent/StandardDocumentation?Versionid=615537; Supplier 1: Farnell; Supplier Part Number 1: 3267800; Supplier 2: DigiKey; Supplier Part Number 2: 448-ISS17EP06LMXTSA1CT-ND; Supplier 3: Mouser; Supplier Part Number 3: 726-ISS17EP06LMXTSA1; Package Description: SOT,0.95mm,pitch;3 pin,1.30mm W X 2.90mm L X 1.10mm H body
R200 R202 R203 R205 R209 = 354562: RES / STD / 47k / 250mW / 1% / 100ppm/K / -55°C to 155°C / 1206(3216) / SMD / -; Multiple Parts: No; Legacy PartNumber: RES01802933; Manufacturer: Vishay; Manufacturer Order Number: CRCW120647K0FK; Symbol Type: Resistor; Single; Standard; 2 Pins; Alternate View: Yes; Article Number: 354562; Version Number: V01; Combined Parameters: TCR:100ppm/K;Tol.:-1%/+1%;Vdc:200V;Idc:-;P:250mW; QuickPick: 47k / 1% / 0.25 / 1206 (3216); Style: Single; Automotive Qualified: AEC Q200; Package Metric: 3216; Package Imperial: 1206; ComponentStatus: Released; PLMStatus: Active; Voltage DC (max): 200V; Legacy DeviceID: RES01802933; Part Type: Resistor; Value: 47k; Tolerance Neg: 1%; Tolerance Pos: 1%; Type: Standard; Technology: Thick Film; Temperature min: -55; Temperature max: 155; Temperature Range: Military; ROHS Compliant: Y; PackageReference: 1206 (3216); ComponentLink1Description: Vendor WebSite; ComponentLink1URL: http://www.vishay.com; ComponentLink2Description: Datasheet; ComponentLink2URL: http://webnetprod.muc.infineon.com/PCBPortal_Prod/WorkFlows/AltiumComponent/StandardDocumentation?Versionid=354563; Supplier 1: Farnell; Supplier 2: DigiKey; Supplier 3: Mouser; Second Source allowed: Yes
R204 = 354752: RES / STD / 100k / 250mW / 1% / 100ppm/K / -55°C to 155°C / 1206(3216) / SMD / -; Multiple Parts: No; Legacy PartNumber: RES01802971; Manufacturer: Vishay; Manufacturer Order Number: CRCW1206100KFK; Symbol Type: Resistor; Single; Standard; 2 Pins; Alternate View: Yes; Article Number: 354752; Version Number: V01; Combined Parameters: TCR:100ppm/K;Tol.:-1%/+1%;Vdc:200V;Idc:-;P:250mW; QuickPick: 100k / 1% / 0.25 / 1206 (3216); Style: Single; Automotive Qualified: AEC Q200; Package Metric: 3216; Package Imperial: 1206; ComponentStatus: Released; PLMStatus: Active; Voltage DC (max): 200V; Legacy DeviceID: RES01802971; Part Type: Resistor; Value: 100k; Tolerance Neg: 1%; Tolerance Pos: 1%; Type: Standard; Technology: Thick Film; Temperature min: -55; Temperature max: 155; Temperature Range: Military; ROHS Compliant: Y; PackageReference: 1206 (3216); ComponentLink1Description: Vendor WebSite; ComponentLink1URL: http://www.vishay.com; ComponentLink2Description: Datasheet; ComponentLink2URL: http://webnetprod.muc.infineon.com/PCBPortal_Prod/WorkFlows/AltiumComponent/StandardDocumentation?Versionid=354753; Supplier 1: Farnell; Supplier 2: DigiKey; Supplier 3: Mouser; Second Source allowed: Yes
R210 R212 = 354312: RES / STD / 17.8k / 250mW / 1% / 100ppm/K / -55°C to 155°C / 1206(3216) / SMD / -; Multiple Parts: No; Legacy PartNumber: RES01802883; Manufacturer: Vishay; Manufacturer Order Number: CRCW120617K8FK; Symbol Type: Resistor; Single; Standard; 2 Pins; Alternate View: Yes; Article Number: 354312; Version Number: V01; Combined Parameters: TCR:100ppm/K;Tol.:-1%/+1%;Vdc:200V;Idc:-;P:250mW; QuickPick: 17.8k / 1% / 0.25 / 1206 (3216); Style: Single; Automotive Qualified: AEC Q200; Package Metric: 3216; Package Imperial: 1206; ComponentStatus: Released; PLMStatus: Active; Voltage DC (max): 200V; Legacy DeviceID: RES01802883; Part Type: Resistor; Value: 17.8k; Tolerance Neg: 1%; Tolerance Pos: 1%; Type: Standard; Technology: Thick Film; Temperature min: -55; Temperature max: 155; Temperature Range: Military; ROHS Compliant: Y; PackageReference: 1206 (3216); ComponentLink1Description: Vendor WebSite; ComponentLink1URL: http://www.vishay.com; ComponentLink2Description: Datasheet; ComponentLink2URL: http://webnetprod.muc.infineon.com/PCBPortal_Prod/WorkFlows/AltiumComponent/StandardDocumentation?Versionid=354313; Supplier 1: Farnell; Supplier 2: DigiKey; Supplier 3: Mouser; Second Source allowed: Yes
R211 = 644055: RES / STD / 15mR / 500mW / 1% / 75ppm/K / -55°C to 155°C / 1206 (3216) / SMD / -; Multiple Parts: No; Manufacturer: Ohmite; Manufacturer Order Number: L4T12FR015FER; Symbol Type: Resistor; 4-Terminal (Shunt); Standard; 4 Pins; Alternate View: Yes; Article Number: 644055; Version Number: V01; Combined Parameters: TCR:75ppm/K;Tol.:-1%/+1%;Vdc:-;Idc:-;P:500mW; QuickPick: 15mR / 1% / 0.5 / 1206 (3216); Style: 4-Terminal (Shunt); ComponentStatus: Released; PLMStatus: Active; Part Type: Resistor; Value: 15mR; Tolerance Neg: 1%; Tolerance Pos: 1%; Type: Standard; Application: Precision; Technology: Thick Film; Temperature min: -55; Temperature max: 155; Temperature Range: Military; ROHS Compliant: Y; Automotive Qualified: No; PackageReference: 1206 (3216); ComponentLink1Description: Vendor WebSite; ComponentLink1URL: http://www.ohmite.com; ComponentLink2Description: Datasheet; ComponentLink2URL: http://webnetprod.muc.infineon.com/PCBPortal_Prod/WorkFlows/AltiumComponent/StandardDocumentation?Versionid=644056; Supplier 1: Farnell; Supplier Part Number 1: 3274221; Supplier 2: DigiKey; Supplier Part Number 2: 273-L4T12FR015FERCT-ND; Supplier 3: Mouser; Supplier Part Number 3: 284-L4T12FR015FER; Second Source allowed: Yes; Package Description: Resistor, SMD, 4 pin, 3.00 mm L X 1.60 mm W X 0.65 mm H body
R214 = 355322: RES / STD / 1MEG / 250mW / 1% / 100ppm/K / -55°C to 155°C / 1206(3216) / SMD / -; Multiple Parts: No; Legacy PartNumber: RES01803085; Manufacturer: Vishay; Manufacturer Order Number: CRCW12061M00FK; Symbol Type: Resistor; Single; Standard; 2 Pins; Alternate View: Yes; Article Number: 355322; Version Number: V01; Combined Parameters: TCR:100ppm/K;Tol.:-1%/+1%;Vdc:200V;Idc:-;P:250mW; QuickPick: 1MEG / 1% / 0.25 / 1206 (3216); Style: Single; Automotive Qualified: AEC Q200; Package Metric: 3216; Package Imperial: 1206; ComponentStatus: Released; PLMStatus: Active; Voltage DC (max): 200V; Legacy DeviceID: RES01803085; Part Type: Resistor; Value: 1MEG; Tolerance Neg: 1%; Tolerance Pos: 1%; Type: Standard; Technology: Thick Film; Temperature min: -55; Temperature max: 155; Temperature Range: Military; ROHS Compliant: Y; PackageReference: 1206 (3216); ComponentLink1Description: Vendor WebSite; ComponentLink1URL: http://www.vishay.com; ComponentLink2Description: Datasheet; ComponentLink2URL: http://webnetprod.muc.infineon.com/PCBPortal_Prod/WorkFlows/AltiumComponent/StandardDocumentation?Versionid=355323; Supplier 1: Farnell; Supplier 2: DigiKey; Supplier 3: Mouser; Second Source allowed: Yes
R631 R633 = 353672: RES / STD / 1.3k / 250mW / 1% / 100ppm/K / -55°C to 155°C / 1206(3216) / SMD / -; Multiple Parts: No; Legacy PartNumber: RES01802755; Manufacturer: Vishay; Manufacturer Order Number: CRCW12061K30FK; Symbol Type: Resistor; Single; Standard; 2 Pins; Alternate View: Yes; Article Number: 353672; Version Number: V01; Combined Parameters: TCR:100ppm/K;Tol.:-1%/+1%;Vdc:200V;Idc:-;P:250mW; QuickPick: 1.3k / 1% / 0.25 / 1206 (3216); Style: Single; Automotive Qualified: AEC Q200; Package Metric: 3216; Package Imperial: 1206; ComponentStatus: Released; PLMStatus: Active; Voltage DC (max): 200V; Legacy DeviceID: RES01802755; Part Type: Resistor; Value: 1.3k; Tolerance Neg: 1%; Tolerance Pos: 1%; Type: Standard; Technology: Thick Film; Temperature min: -55; Temperature max: 155; Temperature Range: Military; ROHS Compliant: Y; PackageReference: 1206 (3216); ComponentLink1Description: Vendor WebSite; ComponentLink1URL: http://www.vishay.com; ComponentLink2Description: Datasheet; ComponentLink2URL: http://webnetprod.muc.infineon.com/PCBPortal_Prod/WorkFlows/AltiumComponent/StandardDocumentation?Versionid=353673; Supplier 1: Farnell; Supplier 2: DigiKey; Supplier 3: Mouser; Second Source allowed: Yes
R632 R634 = 354647: RES / STD / 64.9k / 250mW / 1% / 100ppm/K / -55°C to 155°C / 1206(3216) / SMD / -; Multiple Parts: No; Legacy PartNumber: RES01802950; Manufacturer: Vishay; Manufacturer Order Number: CRCW120664K9FK; Symbol Type: Resistor; Single; Standard; 2 Pins; Alternate View: Yes; Article Number: 354647; Version Number: V01; Combined Parameters: TCR:100ppm/K;Tol.:-1%/+1%;Vdc:200V;Idc:-;P:250mW; QuickPick: 64.9k / 1% / 0.25 / 1206 (3216); Style: Single; Automotive Qualified: AEC Q200; Package Metric: 3216; Package Imperial: 1206; ComponentStatus: Released; PLMStatus: Active; Voltage DC (max): 200V; Legacy DeviceID: RES01802950; Part Type: Resistor; Value: 64.9k; Tolerance Neg: 1%; Tolerance Pos: 1%; Type: Standard; Technology: Thick Film; Temperature min: -55; Temperature max: 155; Temperature Range: Military; ROHS Compliant: Y; PackageReference: 1206 (3216); ComponentLink1Description: Vendor WebSite; ComponentLink1URL: http://www.vishay.com; ComponentLink2Description: Datasheet; ComponentLink2URL: http://webnetprod.muc.infineon.com/PCBPortal_Prod/WorkFlows/AltiumComponent/StandardDocumentation?Versionid=354648; Supplier 1: Farnell; Supplier 2: DigiKey; Supplier 3: Mouser; Second Source allowed: Yes
S200 = 650099: Slid Switch, 12V, 200mA; Manufacturer: NIDEC COPAL ELECTRONICS, Inc.; Symbol Type: Switch, 2 Change Over 1 3, 3 Pins; Article Number: 650099; Version Number: V00; Automotive Qualified: No; ComponentStatus: Released; PLMStatus: Active; Second Source allowed: Yes; Voltage DC (max): na; Part Type: Electro Mechanic; Manufacturer Order Number: CL-SB-12A-01T; Value: CL-SB-12A-01T; Application: Power; Temperature min: -40; Temperature max: 85; Temperature Range: Industrial; ROHS Compliant: Y; ComponentLink1Description: Vendor WebSite; ComponentLink1URL: www.copal-electronics.com/; ComponentLink2Description: Datasheet; ComponentLink2URL: http://webnetprod.muc.infineon.com/PCBPortal_Prod/WorkFlows/AltiumComponent/StandardDocumentation?Versionid=650100; Supplier 1: Farnell; Supplier Part Number 1: 2854744; Supplier 2: DigiKey; Supplier Part Number 2: 563-1314-1-ND; Supplier 3: Mouser; Supplier Part Number 3: 229-CL-SB-12A-01T; Package Description: Switch, SMD, 3 Pins, 3.50 mm W X 8.50 mm L X 6.10 mm H body
TP211 TP630 = 382400: PC Test Point-Multipurpose THT, Red; Multiple Parts: No; Legacy PartNumber: CON01500529; Manufacturer: Keystone Electronics Corp.; Symbol Type: Connector, 1 Lead, Female; Alternate View: Yes; Article Number: 382400; Version Number: V01; Legacy DeviceID: KEY_5010; Combined Parameters: Board-to-Cable None (onboard);1x1;Mounting:THT;Orient:0° (vertical);Shielded:No; QuickPick: 0° (vertical) / Board-to-Cable; Style: Not Applicable; ComponentStatus: Released; PLMStatus: Active; Voltage DC (max): na; Part Type: Connector; Manufacturer Order Number: 5010; Value: 5010; Type: Board-to-Cable; Application: Test; Temperature min: 0; Temperature max: 0; Temperature Range: Military; ROHS Compliant: Y; Automotive Qualified: No; ComponentLink1Description: Vendor WebSite; ComponentLink1URL: http://www.keyelco.com/; ComponentLink2Description: Datasheet; ComponentLink2URL: http://webnetprod.muc.infineon.com/PCBPortal_Prod/WorkFlows/AltiumComponent/StandardDocumentation?Versionid=382401; Supplier 1: Farnell; Supplier Part Number 1: 2301288; Supplier 2: DigiKey; Supplier Part Number 2: 36-5010-ND; Supplier 3: Mouser; Supplier Part Number 3: 534-5010; Second Source allowed: Yes; Package Description: Test Point, 1.78 mm Lead Width, Round, 3.17 mm Dia X 8.28 mm H body
U630 = 699374: Manufacturer: Texas Instruments; Symbol Type: High-Precision, Low-Noise, Rail-to-Rail Output, JFET Op Amp; Alternate View: Yes; Article Number: 699374; Version Number: V00; Legacy DeviceID: TI_OPA197IDR; Combined Parameters: Res.:-;Fmax:10MHz; QuickPick: Amplifier / SOIC; Automotive Qualified: No; ComponentStatus: Released; PLMStatus: Active; Voltage DC (max): na; Multiple Parts: Yes; Part Type: Analog Parts; Manufacturer Order Number: OPA197IDR; Value: OPA197IDR; Type: Amplifier; Application: Power Electronics; Temperature min: -40; Temperature max: 125; Temperature Range: Automotive; ROHS Compliant: Y; PackageReference: SOIC; ComponentLink1Description: Vendor WebSite; ComponentLink1URL: http://www.ti.com; ComponentLink2Description: Datasheet; ComponentLink2URL: http://webnetprod.muc.infineon.com/PCBPortal_Prod/WorkFlows/AltiumComponent/StandardDocumentation?Versionid=699375; Supplier 1: Farnell; Supplier Part Number 1: 3117357; Supplier 2: DigiKey; Supplier Part Number 2: 296-43866-1-ND; Supplier 3: Mouser; Supplier Part Number 3: 595-OPA197IDR; Second Source allowed: Yes; Package Description: SOIC,1.27mm pitch;8 pin,3.895mm W X 4.905mm L X 1.75mm H body

## Nets that join several sheets
GND: 02_Top_Level (5 pins), Input (13 pins)
12V: 02_Top_Level (X_Board_Output.1), Input (C630.2 U630.7)
Input_Current: 02_Top_Level (X_Board_Output.2), Input (R634.2 TP630.1 U630.6)
NetQ200_2: 02_Top_Level (X100.1 X100.2), Input (Q200.2)
Vin: 02_Top_Level (X_Board_Output.3), Input (7 pins)

## Assembly variants
Default_Assembly: not fitted C312 C511 C515 C521 C522 C600 C? JP421 MP100 MP100 MP101 MP101 MP102 MP102 MP103 MP103 R213 TP611 U420 U421 X110 X?
OnlySMD: not fitted C210 C312 C511 C515 C521 C522 C600 JP110 JP110 JP111 JP111 JP111 JP112 JP120 JP121 JP122 JP122 JP123 JP124 JP125 JP126 JP127 JP128 JP130 JP212 JP421 JP421 JP421 JP701 JP710 JP710 JP710 JP710 JP710 JP723 MP100 MP100 MP101 MP101 MP102 MP102 MP103 MP103 R213 R509 R513 TP100 TP100 TP101 TP101 TP102 TP102 TP103 TP103 TP103 TP104 TP104 TP105 TP105 TP106 TP107 TP202 TP300 TP300 TP421 TP421 TP503 TP611 TP710 TP802 U420 U421 X100 X101 X110 X110 X140 X140 X140 X140 X140 X140 X140 X150 X150 X150 X720 X720 X720 X?